# Altium schematic sheet Adafruit ESP8266 Feather.SchDoc
size 282 x 200 mm; COMPANY: Pinion Labs; DRAWN: Malcolm; REV: A
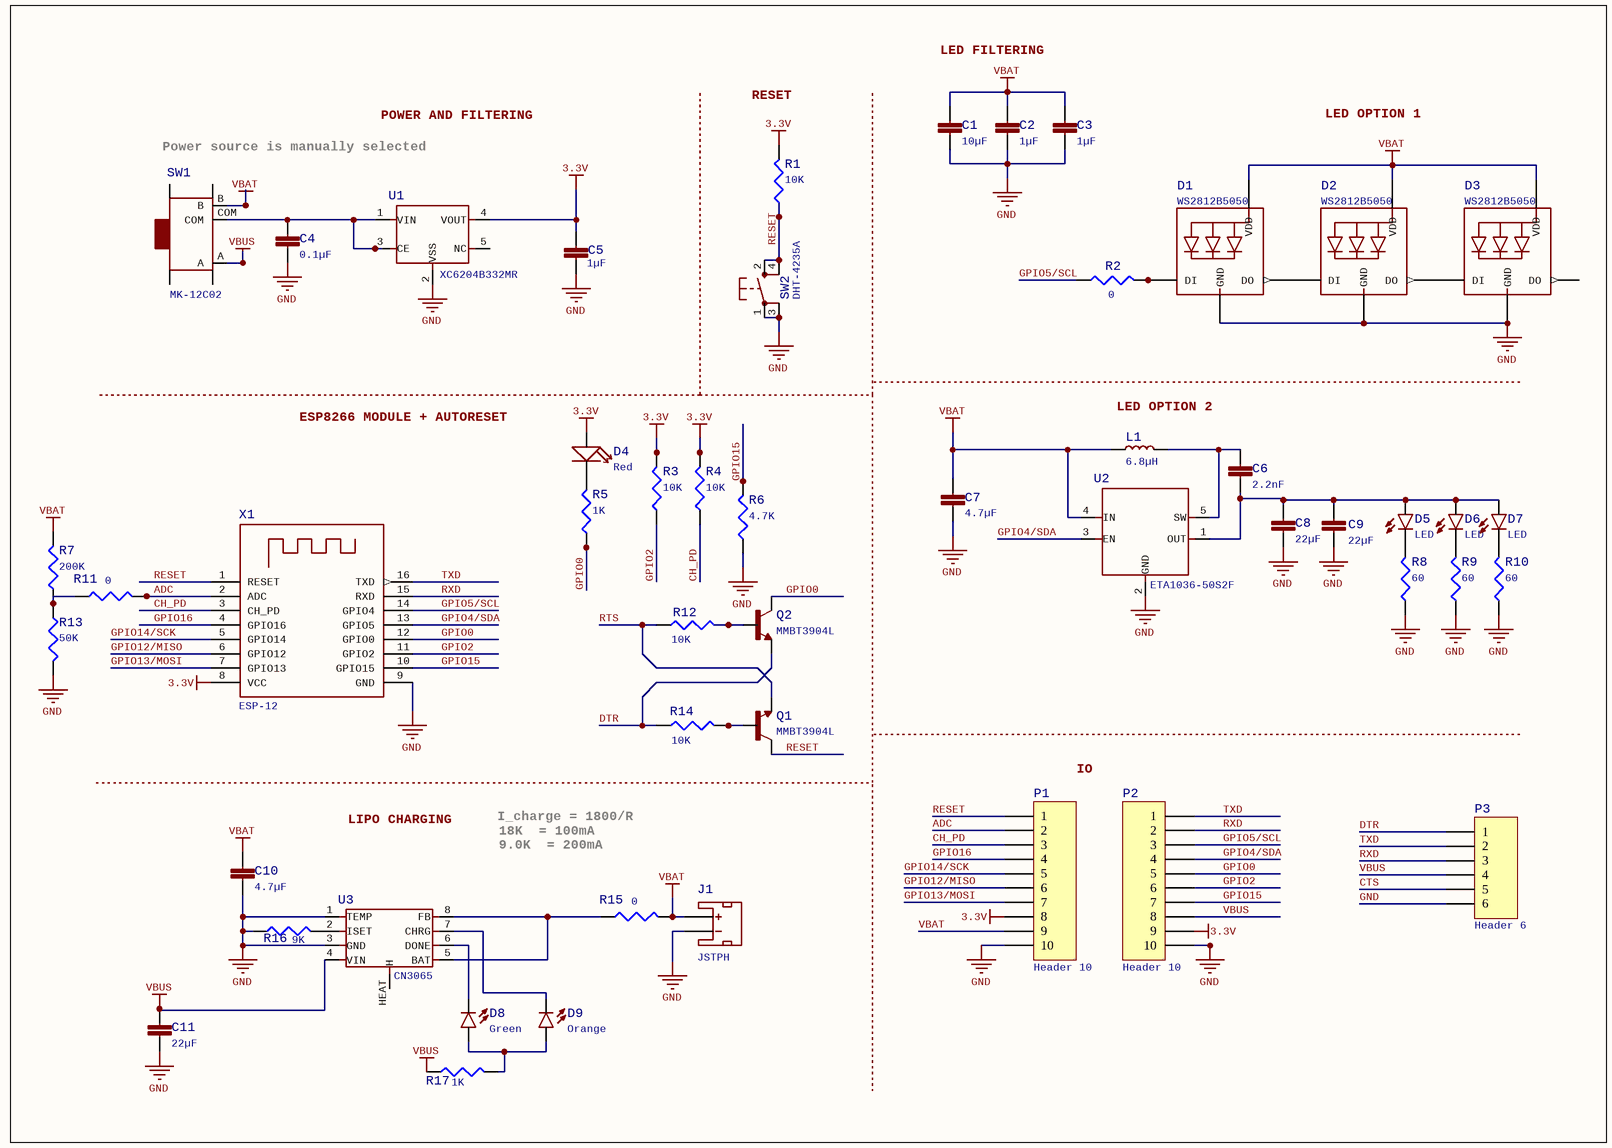
[diagram p0: Adafruit ESP8266 Feather.SchDoc]

## Parts
C1  10µF  [0805]
C2  1µF  [0603]
C3  1µF  [0603]
C4  0.1µF  [0805]
C5  1µF  [0603]
C6  2.2nF  [0603]
C7  4.7µF  [0805]
C8  22µF  [0805]
C9  22µF  [0805]
C10  4.7µF  [0805]
C11  22µF  [0805]
D1  WS2812B5050  [WS2812B]
D2  WS2812B5050  [WS2812B]
D3  WS2812B5050  [WS2812B]
D4  Red  [LED-0603]
D5  LED  [LED_5MM]
D6  LED  [LED_5MM]
D7  LED  [LED_5MM]
D8  Green  [LED-0603]
D9  Orange  [LED-0603]
J1  JSTPH  [JST-2-SMD]
L1  6.8µH  [L0603]
P1  Header 10  [HDR1X10]
P2  Header 10  [HDR1X10]
P3  Header 6  [HDR1X6]
Q1  MMBT3904L  [SOT23-3]
Q2  MMBT3904L  [SOT23-3]
R1  value 10K  [J1-0603]  (hidden comment: Res3)
R2  value 0  [J1-0603]  (hidden comment: Res3)
R3  value 10K  [J1-0603]  (hidden comment: Res3)
R4  value 10K  [J1-0603]  (hidden comment: Res3)
R5  value 1K  [J1-0603]  (hidden comment: Res3)
R6  value 4.7K  [J1-0603]  (hidden comment: Res3)
R7  value 200K  [J1-0603]  (hidden comment: Res3)
R8  value 60  [J1-0603]  (hidden comment: Res3)
R9  value 60  [J1-0603]  (hidden comment: Res3)
R10  value 60  [J1-0603]  (hidden comment: Res3)
R11  value 0  [J1-0603]  (hidden comment: Res3)
R12  value 10K  [J1-0603]  (hidden comment: Res3)
R13  value 50K  [J1-0603]  (hidden comment: Res3)
R14  value 10K  [J1-0603]  (hidden comment: Res3)
R15  value 0  [J1-0603]  (hidden comment: Res3)
R16  value 9K  [J1-0603]  (hidden comment: Res3)
R17  value 1K  [J1-0603]  (hidden comment: Res3)
SW1  MK-12C02  [SW7-SMD-L6.7X2.7X3.2MM]
SW2  DHT-4235A  [KMR2]
U1  XC6204B332MR  [SOT-23-5]
U2  ETA1036-50S2F  [SOT-23-5]
U3  CN3065  [DFN8G-0.5-3X3MM]
X1  ESP-12  [ESP-12]

## Nets
3.3V: C5.1 D4.+ P1.8 P2.9 R1.2 R3.2 R4.2 U1.4(VOUT) X1.8(VCC)
GND: C1.2 C2.2 C3.2 C4.2 C5.2 C7.2 C8.2 C9.2 C10.2 C11.2 D1.3-GND(GND) D2.3-GND(GND) D3.3-GND(GND) J1.1(-) P1.10 P2.10 P3.6 R6.1 R8.1 R9.1 R10.1 R13.2 R16.1 SW2.1(P) SW2.3(P1) U1.2(VSS) U2.2(GND) U3.1(TEMP) U3.3(GND) X1.9(GND)
VBAT: C1.1 C2.1 C3.1 C7.1 C10.1 D1.1-VDD(VDD) D2.1-VDD(VDD) D3.1-VDD(VDD) J1.2(+) L1.1 P1.9 R7.2 R15.2 SW1.B U2.4(IN)
VBUS: C11.1 P2.8 P3.4 R17.1 SW1.A U3.4(VIN)
ADC: P1.2 R11.2 X1.2(ADC)
CH_PD: P1.3 R4.1 X1.3(CH_PD)
CTS: P3.5
DTR: P3.1 Q2.2(E) R14.1
GPIO0: P2.5 Q2.3(C) R5.1 X1.12(GPIO0)
GPIO2: P2.6 R3.1 X1.11(GPIO2)
GPIO4/SDA: P2.4 U2.3(EN) X1.13(GPIO5)
GPIO5/SCL: P2.3 R2.1 X1.14(GPIO4)
GPIO12/MISO: P1.6 X1.6(GPIO12)
GPIO13/MOSI: P1.7 X1.7(GPIO13)
GPIO14/SCK: P1.5 X1.5(GPIO14)
GPIO15: P2.7 R6.2 X1.10(GPIO15)
GPIO16: P1.4 X1.4(GPIO16)
RESET: P1.1 Q1.3(C) R1.1 SW2.2(S) SW2.4(S1) X1.1(RESET)
RTS: Q1.2(E) R12.1
RXD: P2.2 P3.3 X1.15(RXD)
TXD: P2.1 P3.2 X1.16(TXD)
NetC4_1: C4.1 SW1.COM U1.1(VIN) U1.3(CE)
NetC6_1: C6.1 L1.2 U2.5(SW)
NetC6_2: C6.2 C8.1 C9.1 D5.A D6.A D7.A U2.1(OUT)
NetD1_2-DOUT: D1.2-DOUT(DO) D2.4-DIN(DI)
NetD1_4-DIN: D1.4-DIN(DI) R2.2
NetD2_2-DOUT: D2.2-DOUT(DO) D3.4-DIN(DI)
NetD4_-: D4.- R5.2
NetD5_K: D5.K(C) R8.2
NetD6_K: D6.K(C) R9.2
NetD7_K: D7.K(C) R10.2
NetD8_A: D8.A D9.A R17.2
NetD8_C: D8.C U3.6(DONE)
NetD9_C: D9.C U3.7(CHRG)
NetQ1_1: Q1.1(B) R14.2
NetQ2_1: Q2.1(B) R12.2
NetR7_1: R7.1 R11.1 R13.1
NetR15_1: R15.1 U3.5(BAT) U3.8(FB)
NetR16_2: R16.2 U3.2(ISET)

Not connected (* = marked no-connect by the designer): D3 2-DOUT(DO); J1 NC1(PAD1) NC2(PAD2); SW1 SS1 SS2 SS3 SS4; U1 5(NC); U3 HEAT(H)

## Notes on the sheet
- LED FILTERING
- Power source is manually selected
- POWER AND FILTERING
- (near R1) RESET
- LED OPTION 1
- ESP8266 MODULE + AUTORESET
- (near L1) LED OPTION 2
- IO
- LIPO CHARGING
- I_charge = 1800/R
- 18K  = 100mA
- 9.0K  = 200mA

## Library data of the parts
C1 C4 C7-C11 = 10UF-0805-10V-10%: PROD_ID: CAP-11330
C2 C3 C5 C6 = 1.0UF-0603-16V-10%: PROD_ID: CAP-00868
D4 = LED-0603
D5-D7 = LED5MM
D8 D9 = LED-RED0603: PROD_ID: DIO-00819
J1 = JST_2MM_MALE: PROD_ID: CONN-11443; SF_ID: PRT-08612
L1 = INDUCTOR/FERRITE-BEAD-0603
P1 P2 = Header 10: Header, 10-Pin; LatestRevisionDate: 17-Jul-2002; LatestRevisionNote: Re-released for DXP Platform.; Publisher: Altium Limited
P3 = Header 6: Header, 6-Pin; LatestRevisionDate: 17-Jul-2002; LatestRevisionNote: Re-released for DXP Platform.; Publisher: Altium Limited
Q1 Q2 = TRANSISTOR_NPNSOT23-3: Transistor NPNBJT configuration in SOT23 package. MMBT2222 is the common NPN we use. Double check BCE configuration again layout.; COMPANY: ADAFRUIT INDUSTRIES; DRAWN: KTOWN; REV: B
R1-R17 = Res3: Resistor; Published: 8-Jun-2000; LatestRevisionDate: 29-May-2009; LatestRevisionNote: IPC-7351 Footprint Added.; PackageReference: J1-0603; Publisher: Altium Limited; PackageDescription: Chip Resistor
SW1 = SMD-TOGGLE-SWITCH-ON-ON(3+4P-6.7X2.7MM): MPN: MK-12C02
SW2 = SPST_TACT-KMR2
U1 = PMIC-LDO-XC6204B332MR(SOT23-5): MPN: XC6204B332MR
U2 = PMIC-ETA1036-50S2F-T(SOT23-5): MPN: ETA1036-50S2F-T
U3 = PMIC-CN3065(DFN8): MPN: CN3065